# EasyEDA Pro project 2.18墨水屏.eprj

# Schematic Schematic1
Create Date: 2024-07-22; Page Name: P1; Project Name: 2.18墨水屏; Schematic Name: Schematic1; Update Date: 2024-07-22; Company: 嘉立创EDA; Page Size: A4; Version: V1.0
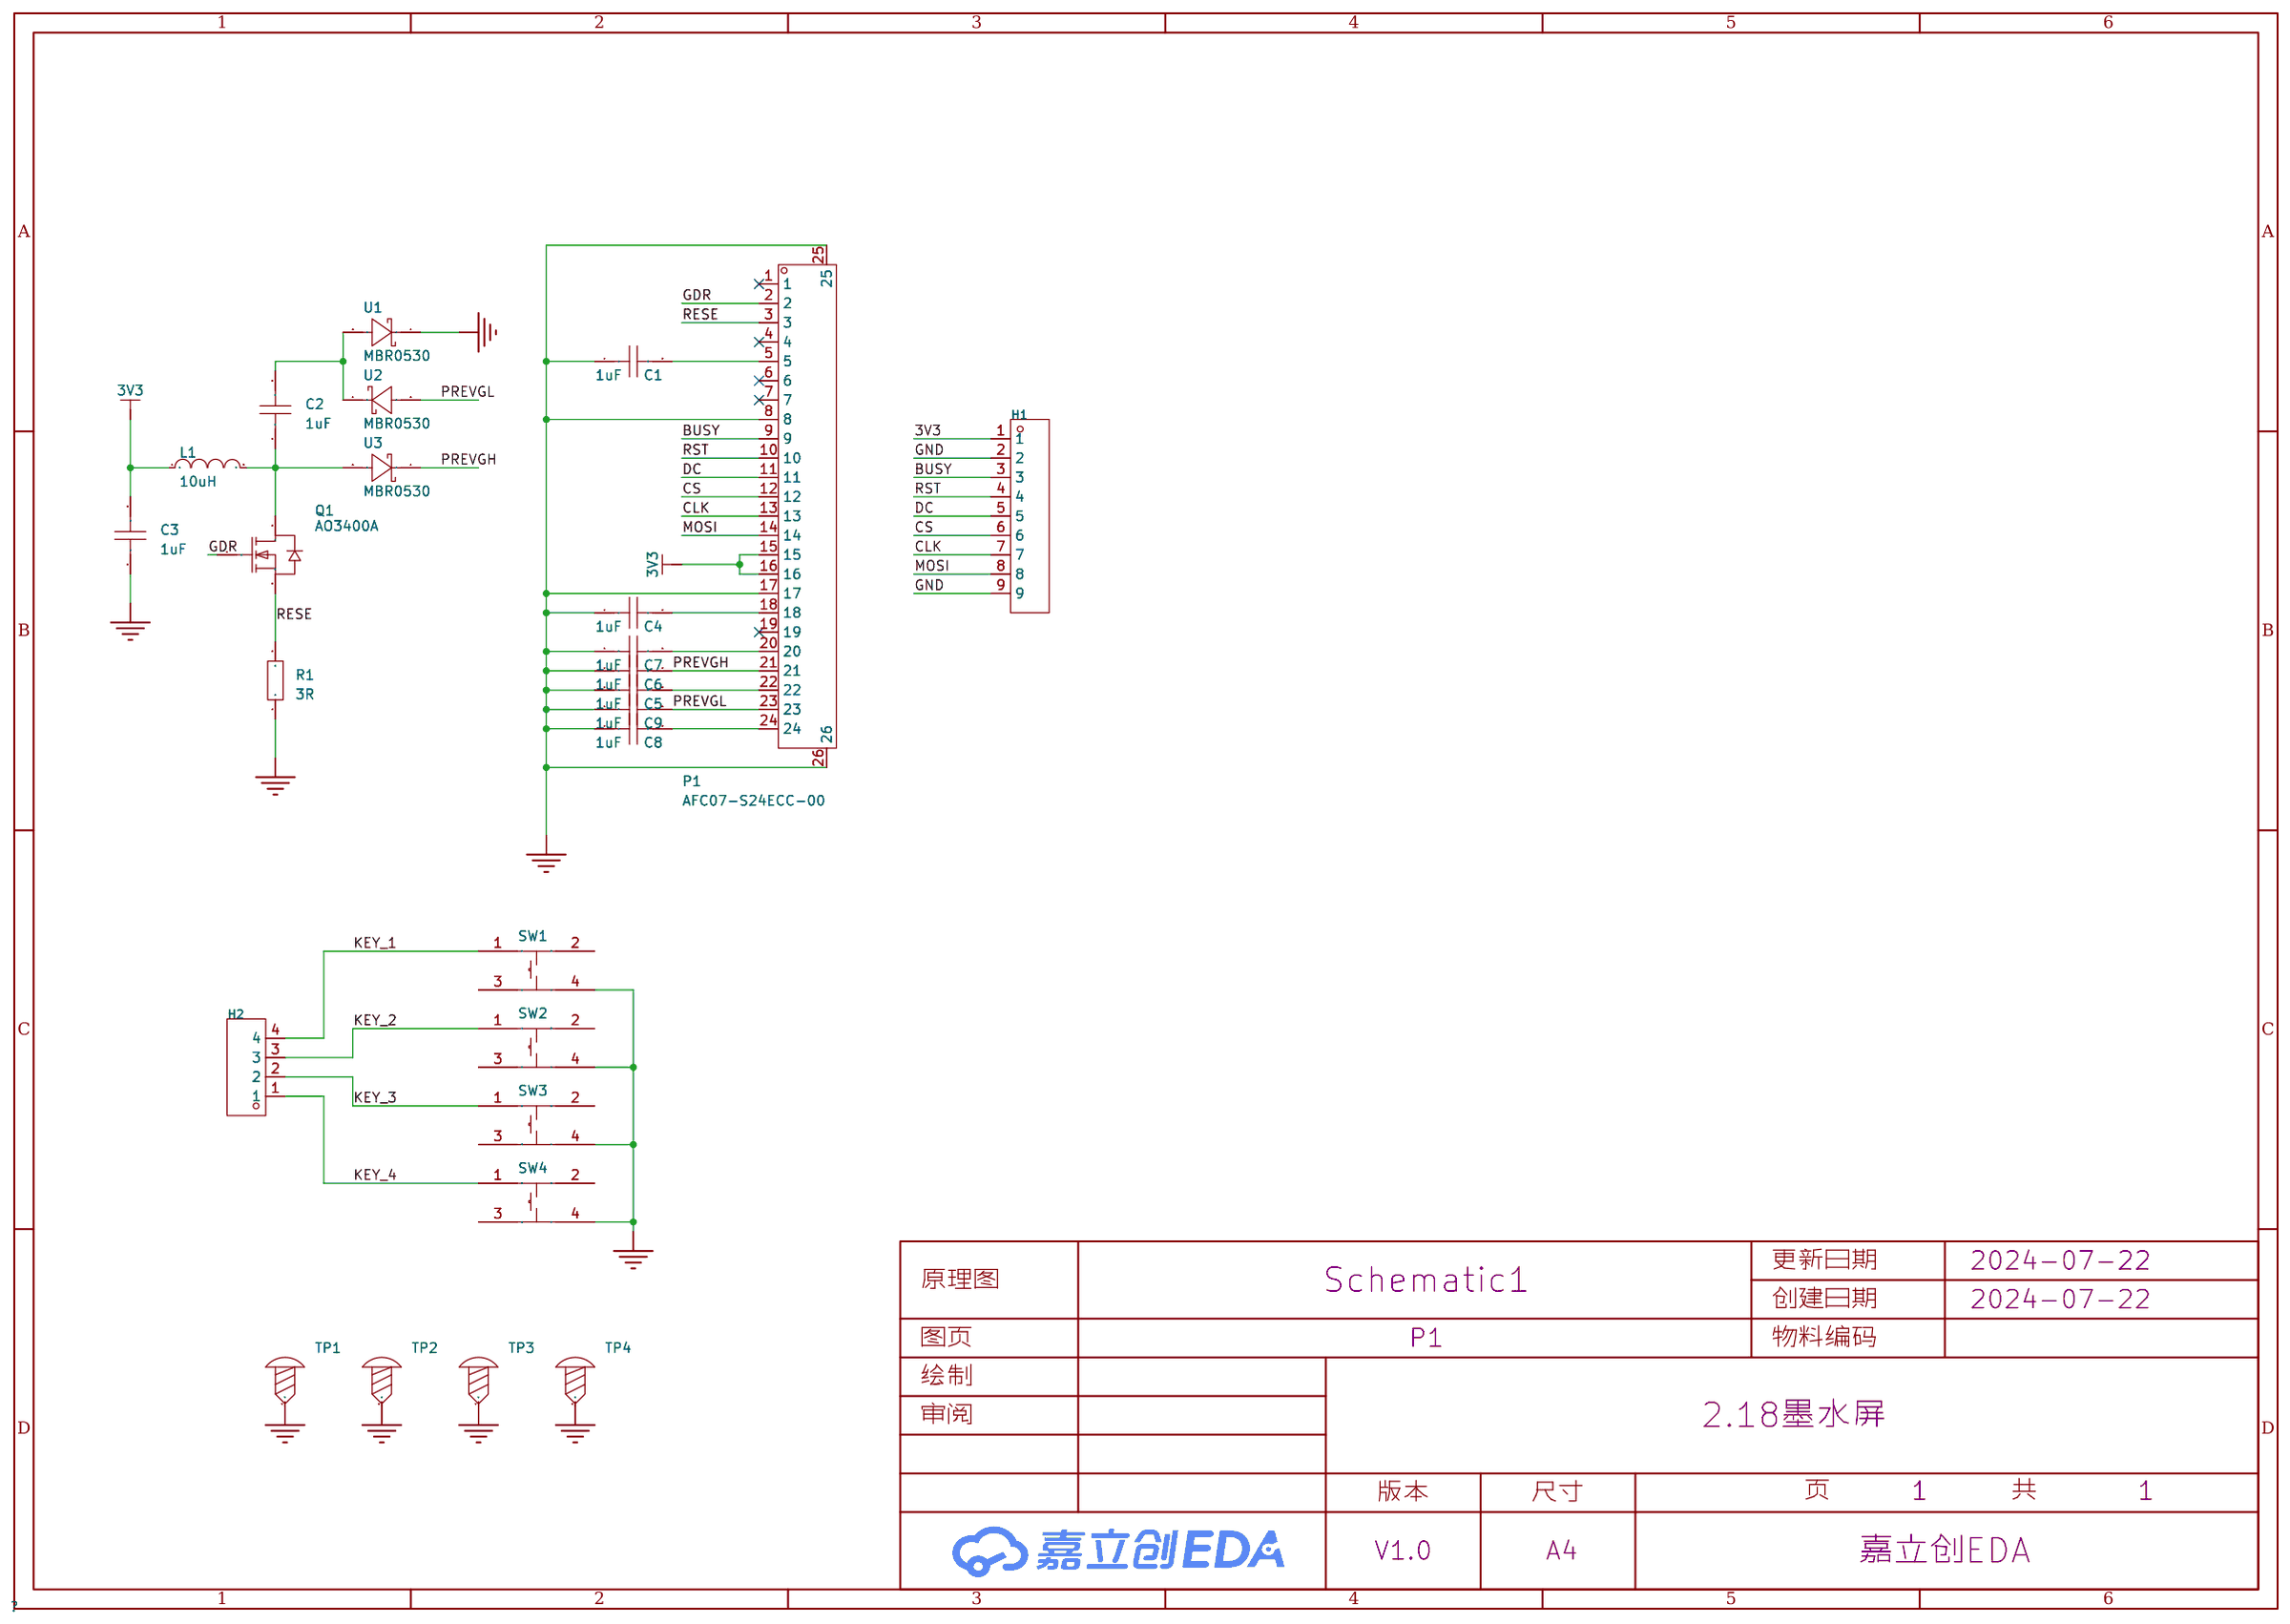
[diagram p0: schematic sheet]

## Parts
C1  1uF  [C0603]
C2  1uF  [C0603]
C3  1uF  [C0603]
C4  1uF  [C0603]
C5  1uF  [C0603]
C6  1uF  [C0603]
C7  1uF  [C0603]
C8  1uF  [C0603]
C9  1uF  [C0603]
H1  -  [HDR-TH_9P-P2.54-V-M]
H2  -  [HDR-TH_4P-P2.54-V-M]
L1  10uH  [L0805]
P1  AFC07-S24ECC-00  [FPC-SMD_24P-L17.5-W5.4-P0.50]
Q1  AO3400A  [SOT-23-3_L2.9-W1.6-P1.90-LS2.8-BR]
R1  3R  [R0603]
SW1  K2-1808SN-A3SW-01  [SW-SMD_4P-L4.2-W3.3-P2.15-LS5.1]
SW2  K2-1808SN-A3SW-01  [SW-SMD_4P-L4.2-W3.3-P2.15-LS5.1]
SW3  K2-1808SN-A3SW-01  [SW-SMD_4P-L4.2-W3.3-P2.15-LS5.1]
SW4  K2-1808SN-A3SW-01  [SW-SMD_4P-L4.2-W3.3-P2.15-LS5.1]
TP1  -  [M3螺丝]
TP2  -  [M3螺丝]
TP3  -  [M3螺丝]
TP4  -  [M3螺丝]
U1  MBR0530  [SOD-123_L2.7-W1.6-LS3.7-RD-1]
U2  MBR0530  [SOD-123_L2.7-W1.6-LS3.7-RD-1]
U3  MBR0530  [SOD-123_L2.7-W1.6-LS3.7-RD-1]

## Library data of the parts
C1-C9 = CAP_0603: Supplier Footprint: 0603
H1 = HDR-M_2.54-1x9P: Supplier Part: C492408; Supplier Footprint: 插件
H2 = HDR-M_2.54_1x4P: Supplier Part: C492403; Supplier Footprint: 插件
L1 = L_0805
P1 = AFC07-S24ECC-00: 锁定特性:抽屉式;触点类型:上接;触点数量:24P;间距:0.5mm;安装类型:卧贴;; LCSC Part Name: 间距:0.5mm P数:24P 抽屉式 上接; Supplier Part: C11092; Manufacturer: JS(钜硕电子); Supplier Footprint: SMD,P=0.5mm,卧贴; JLCPCB Part Class: 扩展库; Datasheet: https://atta.szlcsc.com/upload/public/pdf/source/20151024/1457707484416.pdf; Supplier: LCSC; Locking Feature: 抽屉式; Contact Type: 上接; Number of Contacts: 24P; Pitch: 0.5mm; Mounting Type: 卧贴; FFC, FCB Thickness: 0.3mm; Height Above Board: 2mm
Q1 = AO3400A_C20917: 类型:1个N沟道;漏源电压(Vdss):30V;连续漏极电流(Id):5.7A;功率(Pd):1.4W;导通电阻(RDS(on)@Vgs,Id):26.5mΩ@10V,5.7A;阈值电压(Vgs(th)@Id):1.5V@250uA;; LCSC Part Name: 1个N沟道 耐压:30V 电流:5.7A; Supplier Part: C20917; Manufacturer: AOS; Supplier Footprint: SOT-23-3L; JLCPCB Part Class: 基础库; Datasheet: https://atta.szlcsc.com/upload/public/pdf/source/20140107/1457706668533.pdf; Supplier: LCSC; Type: 1个N沟道; Drain Source Voltage (Vdss): 30V; Continuous Drain Current (Id): 5.7A; Power Dissipation (Pd): 1.4W; Drain Source On Resistance (RDS(on)@Vgs,Id): 26.5mΩ@10V,5.7A; Gate Threshold Voltage (Vgs(th)@Id): 1.5V@250uA; Total Gate Charge (Qg@Vgs): 7nC@4.5V; Input Capacitance (Ciss@Vds): 630pF@15V; Operating Temperature: -55℃~+150℃@(Tj)
R1 = Res_0603: Supplier Footprint: 0603
SW1-SW4 = K2-1808SN-A3SW-01: 触点电流:50mA;额定电压(DC):12V;绝缘电阻:100MΩ;安装方式:立贴;作用力:180gf@±30gf;机械寿命:100000;工作温度:-25℃~+85℃;开关长度:4.2mm;开关宽度:3.25mm;开关高度:2.5mm;; LCSC Part Name: 3*4*2.5 贴片开关180G; Supplier Part: C2690012; Manufacturer: 韩国韩荣; Supplier Footprint: SMD; JLCPCB Part Class: Extended Part; Datasheet: https://atta.szlcsc.com/upload/public/pdf/source/20180927/C283535_7E7907F3E7B6C1691E1DC87E363D082A.pdf; Supplier: LCSC; Contact Current: 50mA; Voltage Rating (DC): 12V; Insulation Resistance: 100MΩ; Mounting Sytle: 立贴; Operating Force: 180gf@±30gf; Mechanical Life: 100000; Operating Temperature: -25℃~+85℃; Switch Length: 4.2mm; Switch Width: 3.25mm; Switch Height: 2.5mm
TP1-TP4 = M3螺丝: Supplier Footprint: 插件
U1-U3 = MBR0530_C5204746: 直流反向耐压(Vr)：30V 平均整流电流(Io)：500mA 正向压降(Vf)：550mV@500mA 30V,0.5A,VF=0.55V@0.5A; Supplier Part: C5204746; Manufacturer: TWGMC(台湾迪嘉); Supplier Footprint: SOD-123; JLCPCB Part Class: 扩展库; Datasheet: https://atta.szlcsc.com/upload/public/pdf/source/20221019/9AF996FD812938C8CF6407F410FBBCF7.pdf; Supplier: LCSC

## Nets
3V3: C3.2 H1.1 L1.1 P1.15 P1.16
GND: C1.1 C3.1 C4.1 C5.1 C6.1 C7.1 C8.1 C9.1 H1.2 H1.9 P1.8 P1.17 P1.25 P1.26 R1.1 SW1.4 SW2.4 SW3.4 SW4.4 TP1.1 TP2.1 TP3.1 TP4.1 U1.1(K)
BUSY: H1.3 P1.9
CLK: H1.7 P1.13
CS: H1.6 P1.12
DC: H1.5 P1.11
GDR: P1.2 Q1.1(G)
KEY_1: H2.4 SW1.1
KEY_2: H2.3 SW2.1
KEY_3: H2.2 SW3.1
KEY_4: H2.1 SW4.1
MOSI: H1.8 P1.14
PREVGH: C6.2 P1.21 U3.1(K)
PREVGL: C9.2 P1.23 U2.2(A)
RESE: P1.3 Q1.2(S) R1.2
RST: H1.4 P1.10
$1N1136: C8.2 P1.24
$1N1140: C5.2 P1.22
$1N1144: C7.2 P1.20
$1N1148: C4.2 P1.18
$1N1174: C1.2 P1.5
$1N2965: C2.2 U1.2(A) U2.1(K)
$1N3139: C2.1 L1.2 Q1.3(D) U3.2(A)

Not connected (* = marked no-connect by the designer): P1 1* 4* 6* 7* 19*; SW1 2 3; SW2 2 3; SW3 2 3; SW4 2 3

# Board PCB1
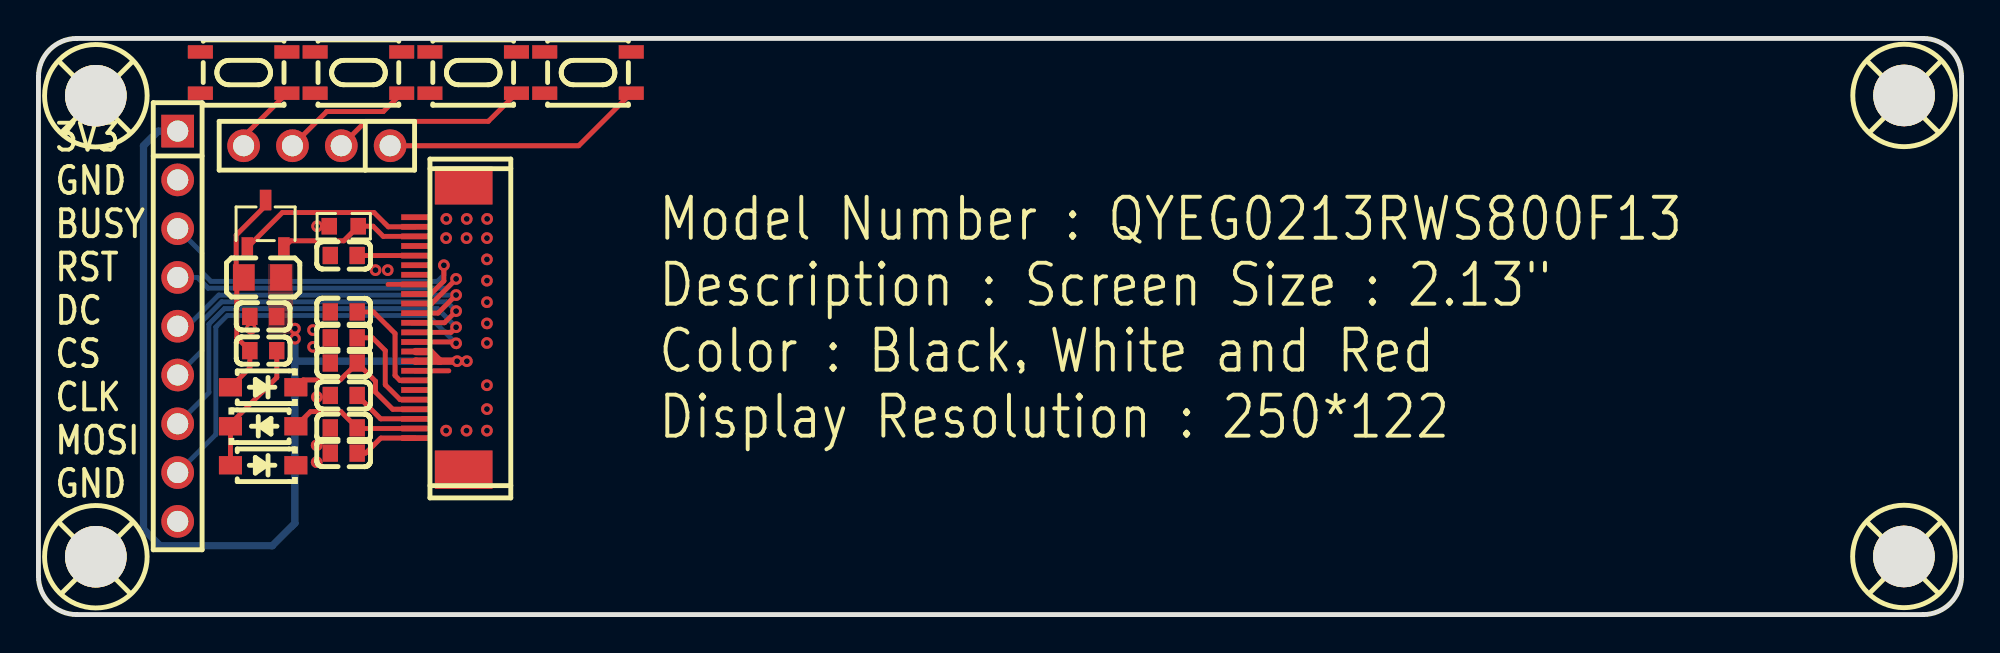
[diagram p1: board, top side]
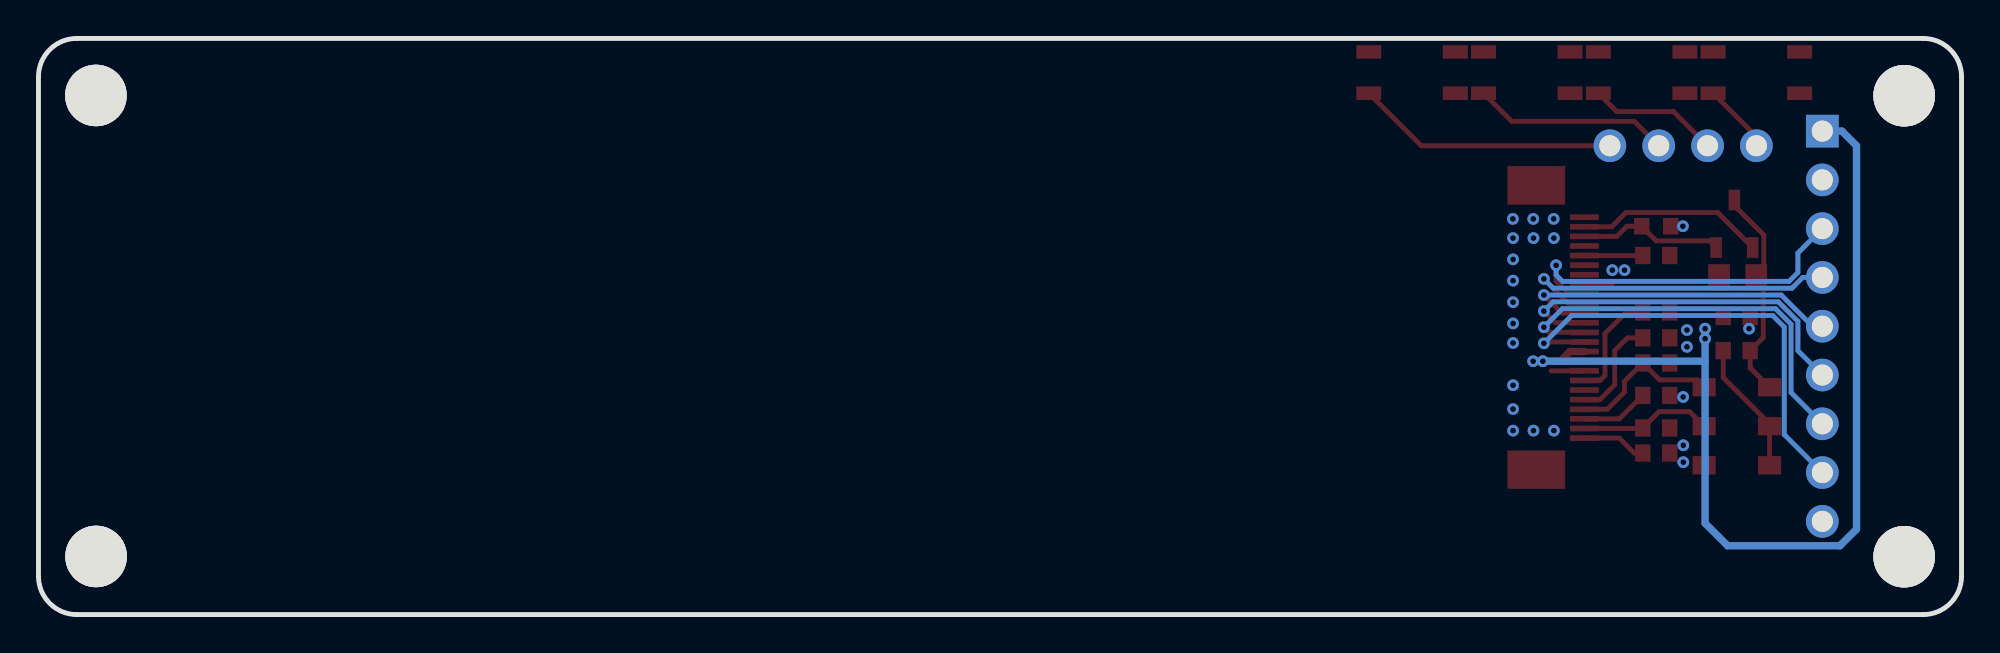
[diagram p2: board, bottom side, seen from below]

Outline 100 x 30 mm; copper layers: Top Layer, Bottom Layer. Coordinates in mm from the lower left corner of the outline.
Outline path: 0,28 0,2 arc(0.59,0.59) 2,0 98,0 arc(99.41,0.59) 100,2 100,28 arc(99.41,29.41) 98,30 2,30 arc(0.59,29.41) 0,28
Stack: Top Layer 0.035mm / Dielectric1 1.51mm FR4 er 4.5 / Bottom Layer 0.035mm

## Design rules (mm)
template: JLCPCB Capability(Two Layers Board)
spacing copperThickness1oz (default): track to track 0.102, other pairs 0.152 to 0.3
spacing copperThickness2oz: track to track 0.203, other pairs 0.152 to 0.3
track width copperThickness1oz (default): min 0.127, default 0.254, max 2.54
track width copperThickness2oz: min 0.203, default 0.254, max 2.54
differential pair differentialPair (default): width min 0.127, default 0.254, max 2.54; gap min 0.152, default 0.152
via viaSize (default): diameter min 0.5, default 0.61, max 10; hole min 0.3, default 0.305, max 6.3

## Placement (name value [footprint] x y rotation side)
C1  1uF  [C0603]  15.88 18.7 0 top
C2  1uF  [C0603]  11.69 13.74 0 top
C3  1uF  [C0603]  11.69 15.52 0 top
C4  1uF  [C0603]  15.88 15.76 0 top
C5  1uF  [C0603]  15.88 11.41 0 top
C6  1uF  [C0603]  15.88 13.1 0 top
C7  1uF  [C0603]  15.88 14.41 0 top
C8  1uF  [C0603]  15.88 8.41 0 top
C9  1uF  [C0603]  15.88 9.72 0 top
H1  -  [HDR-TH_9P-P2.54-V-M]  7.24 15.01 270 top
H2  -  [hdr-th_4p-p2.54-v-m]  14.48 24.41 180 top
L1  10uH  [L0805]  11.64 17.55 180 top
P1  AFC07-S24ECC-00  [FPC-SMD_24P-L17.5-W5.4-P0.50]  20.86 14.95 90 top
Q1  AO3400A  [SOT-23-3_L2.9-W1.6-P1.90-LS2.8-BR]  11.81 20.35 270 top
R1  3R  [R0603]  15.88 20.22 0 top
SW1  K2-1808SN-A3SW-01  [SW-SMD_4P-L4.2-W3.3-P2.15-LS5.1]  10.67 28.22 180 top
SW2  K2-1808SN-A3SW-01  [SW-SMD_4P-L4.2-W3.3-P2.15-LS5.1]  16.64 28.22 180 top
SW3  K2-1808SN-A3SW-01  [SW-SMD_4P-L4.2-W3.3-P2.15-LS5.1]  22.61 28.22 180 top
SW4  K2-1808SN-A3SW-01  [SW-SMD_4P-L4.2-W3.3-P2.15-LS5.1]  28.58 28.22 180 top
TP1  -  [M3螺丝]  3.05 26.95 0 top
TP2  -  [M3螺丝]  3.05 2.95 0 top
TP3  -  [M3螺丝]  97.08 26.97 0 top
TP4  -  [M3螺丝]  97.07 2.96 0 top
U1  MBR0530  [SOD-123_L2.7-W1.6-LS3.7-RD-1]  11.68 7.77 180 top
U2  MBR0530  [SOD-123_L2.7-W1.6-LS3.7-RD-1]  11.68 9.81 0 top
U3  MBR0530  [SOD-123_L2.7-W1.6-LS3.7-RD-1]  11.68 11.84 180 top

## Footprints (pads in the part's own frame, mm; a bottom-side part is the same pattern mirrored in y, then rotated)
C0603
  rect 0.8x0.9 smd: 1(-0.7,0) 2(0.7,0)
FPC-SMD_24P-L17.5-W5.4-P0.50
  rect 0.3x1.5 smd: 1(5.745,1.25) 2(5.245,1.25) 3(4.745,1.25) 4(4.245,1.25) 5(3.745,1.25) 6(3.245,1.25) 7(2.745,1.25) 8(2.245,1.25) 9(1.746,1.25) 10(1.246,1.25) 11(0.746,1.25) 12(0.245,1.25) 13(-0.255,1.25) 14(-0.754,1.25) 15(-1.25,1.25) 16(-1.754,1.25) 17(-2.255,1.25) 18(-2.754,1.25) 19(-3.254,1.25) 20(-3.756,1.25) 21(-4.256,1.25) 22(-4.756,1.25) 23(-5.256,1.25) 24(-5.756,1.25)
  rect 2x3 smd: 25(-7.401,-1.25) 26(7.401,-1.25)
hdr-th_4p-p2.54-v-m
  round 1.7 hole 1.1: 1(-3.81,0) 2(-1.27,0) 3(1.27,0) 4(3.81,0)
HDR-TH_9P-P2.54-V-M
  rect 1.7x1.7 hole 1.1: 1(-10.16,0)
  round 1.7 hole 1.1: 2(-7.62,0) 3(-5.08,0) 4(-2.54,0) 5(0,0) 6(2.54,0) 7(5.08,0) 8(7.62,0) 9(10.16,0)
L0805
  rect 1.133x1.377 smd: 1(-0.966,0) 2(0.966,0)
M3螺丝
  round 3.2 hole 3.2: 1(-0.064,0.064)
R0603
  rect 0.806x0.864 smd: 1(-0.753,0) 2(0.753,0)
SOD-123_L2.7-W1.6-LS3.7-RD-1
  rect 1.2x0.95 smd: 1(-1.7,0) 2(1.7,0)
SOT-23-3_L2.9-W1.6-P1.90-LS2.8-BR
  rect 1.07x0.6 smd: 1(1.235,-0.95) 2(1.235,0.95) 3(-1.235,0)
SW-SMD_4P-L4.2-W3.3-P2.15-LS5.1
  rect 1.3x0.7 smd: 1(-2.25,1.075) 2(2.25,1.075) 3(-2.25,-1.075) 4(2.25,-1.075)

## Nets
As in the schematic.

Pads without a net: P1 1 4 6 7 19; SW1 2 3; SW2 2 3; SW3 2 3; SW4 2 3

## Via types
v1: diameter 0.61, hole 0.305, Top Layer to Bottom Layer, 35 vias

## Routing (per net, layer and track width the routed paths; a pad name or vN(x,y) marks a point on that pad's centre or on a via; arc(x,y) is an arc through that point)
3V3: length 53.5
  Top Layer w0.381: 20.87,13.2 20.37,13.7 P1.15 ; 20.87,13.2 19.62,13.2 P1.16 ; 20.87,13.2 22.27,13.2 v1(22.28,13.19)
  Bottom Layer w0.381: H1.1 6.22,25.17 5.46,24.41 5.46,4.45 6.32,3.58 12.16,3.58 13.34,4.76 13.34,13.19 ; 13.34,13.19 v1(13.34,14.89) ; 13.34,13.19 v1(21.77,13.19)
  vias: v1(13.34,14.36)
GND: length 3.2
  Top Layer w0.254: P1.8 18.18,17.19 ; 21.34,12.69 P1.17
  vias: v1(11.05,14.89) v1(14.28,14.81) v1(14.28,13.94) v1(14.48,11.33) v1(14.47,8.82) v1(14.47,7.94) v1(14.49,20.22) v1(17.53,17.93) v1(18.16,17.93) v1(21.21,20.6) v1(21.2,19.6) v1(21.2,9.58) v1(22.27,20.6) v1(22.26,19.6) v1(22.26,9.58) v1(23.33,20.6) v1(23.32,19.6) v1(23.32,18.5) v1(23.32,17.39) v1(23.32,16.27) v1(23.32,15.16) v1(23.32,14.14) v1(23.32,11.94) v1(23.32,10.7) v1(23.32,9.58)
BUSY: length 19
  Top Layer w0.254: 19.41,16.7 20.41,16.7 21.08,17.37 v1(21.08,18.19)
  Bottom Layer w0.254: v1(21.08,18.19) 21.08,17.68 20.75,17.35 8.97,17.35 8.51,17.81 8.51,18.82 H1.3
CLK: length 21.9
  Top Layer w0.254: v1(21.72,14.96) 21.45,14.7 19.4,14.7
  Bottom Layer w0.254: v1(21.72,14.96) 20.75,15.93 9.67,15.93 8.86,15.12 8.86,11.56 H1.7
CS: length 19.7
  Top Layer w0.254: 19.41,15.2 21.11,15.2 v1(21.72,15.8)
  Bottom Layer w0.254: H1.6 8.51,13.74 8.51,15.27 9.52,16.28 21.23,16.28 v1(21.72,15.8)
DC: length 17.9
  Top Layer w0.254: 19.41,15.7 20.77,15.7 v1(21.72,16.64)
  Bottom Layer w0.254: v1(21.72,16.64) 9.38,16.64 7.75,15.01 H1.5
GDR: length 9.8
  Top Layer w0.254: P1.2 18.19,20.19 17.45,20.93 12.68,20.93 Q1.1
KEY_1: length 3.7
  Top Layer w0.254: H2.4 10.67,24.9 SW1.1
KEY_2: length 6.8
  Top Layer w0.254: H2.3 14.99,26.19 17.93,26.19 SW2.1
KEY_3: length 10.2
  Top Layer w0.254: H2.2 17.02,25.68 23.39,25.68 SW3.1
KEY_4: length 13.7
  Top Layer w0.254: SW4.1 28.09,24.41 H2.1
MOSI: length 24.1
  Top Layer w0.254: v1(21.72,14.12) 21.65,14.2 19.4,14.2
  Bottom Layer w0.254: H1.8 9.22,9.38 9.22,14.97 9.82,15.57 20.27,15.57 v1(21.72,14.12)
PREVGH: length 8.1
  Top Layer w0.254: 13.38,11.84 13.77,12.22 15.7,12.22 C6.2 17.53,12.15 17.53,11.58 18.42,10.69 P1.21
PREVGL: length 6.9
  Top Layer w0.254: 13.38,9.81 14.15,10.57 15.73,10.57 C9.2 16.6,9.69 P1.23
RESE: length 7.7
  Top Layer w0.254: R1.2 16.63,20.21 15.88,19.46 13.11,19.46 Q1.2 ; R1.2 17.4,20.22 17.93,19.69 P1.3 ; R1.2 16.63,20.35
RST: length 17.8
  Top Layer w0.254: 19.41,16.2 20.45,16.2 21.72,17.47 v1(21.72,17.48)
  Bottom Layer w0.254: H1.4 8.26,17.55 8.82,16.99 21.23,16.99 v1(21.72,17.48)
$1N1136: length 3.4
  Top Layer w0.254: C8.2 17.02,8.41 17.8,9.19 P1.24
$1N1140: length 3.5
  Top Layer w0.254: P1.22 17.79,10.19 C5.2
$1N1144: length 5.4
  Top Layer w0.254: C7.2 17.37,14.41 18.03,13.74 18.03,11.97 18.81,11.19 P1.20
$1N1148: length 5.8
  Top Layer w0.254: C4.2 17.42,15.76 18.54,14.63 18.54,12.45 18.8,12.19 P1.18
$1N1174: length 3.2
  Top Layer w0.254: 16.58,18.38 16.89,18.69 P1.5
$1N2965: length 7.1
  Top Layer w0.254: 9.98,7.65 9.98,9.93 12.39,12.34 C2.2
$1N3139: length 11.4
  Top Layer w0.254: U3.2 10.99,12.85 C2.1 10.31,14.42 10.31,17.19 L1.2 10.68,17.68 10.28,18.07 10.28,19.76 11.81,21.29 Q1.3

## Copper pours and planes (outline as drawn; the poured copper is in the pictures)
3V3 on Top Layer: 11.94,18.25 13.25,18.25 13.25,14.61 11.94,14.61
GND on Top Layer: -5.33,32.67 101.09,32.67 101.09,-6.07 -5.33,-6.07
GND on Bottom Layer: -1.27,34.44 110.11,34.44 110.11,-2.77 -1.27,-2.77

## Text on the board
Top Silkscreen Layer: 3V3 / GND / BUSY / RST / DC / CS / CLK / MOSI / GND | Model Number : QYEG0213RWS800F13 / Description : Screen Size : 2.13" / Color : Black，White and Red / Display Resolution : 250*122
